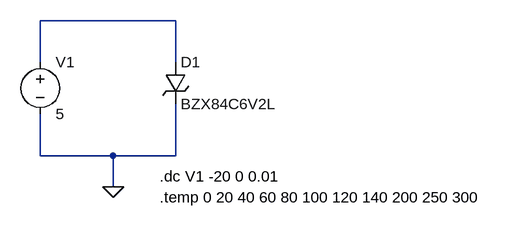
[diagram p0: schematic 1_c_Diodo_Zemer_Analisis_temp_e_Is_diferentes_.asc]
1_c_Diodo_Zemer_Analisis_temp_e_Is_diferentes_.asc, the LTspice schematic file:
Version 4
SHEET 1 880 680
WIRE 112 48 -96 48
WIRE -96 112 -96 48
WIRE 112 112 112 48
WIRE -96 256 -96 192
WIRE 16 256 -96 256
WIRE 112 256 112 176
WIRE 112 256 16 256
WIRE 16 304 16 256
FLAG 16 304 0
SYMBOL voltage -96 96 R0
WINDOW 123 0 0 Left 0
WINDOW 39 0 0 Left 0
SYMATTR InstName V1
SYMATTR Value 5
SYMBOL zener 96 112 R0
SYMATTR InstName D1
SYMATTR Value BZX84C6V2L
SYMATTR Description Diode
SYMATTR Type diode
TEXT 88 288 Left 2 !.dc V1 -20 0 0.01
TEXT 88 320 Left 2 !.temp 0 20 40 60 80 100 120 140 200 250 300

The netlist it stands for:
* 1_c_Diodo_Zemer_Analisis_temp_e_Is_diferentes_.asc
V1 N001 0 5
D1 N001 0 BZX84C6V2L
.model D D
.lib standard.dio
.dc V1 -20 0 0.01
.temp 0 20 40 60 80 100 120 140 200 250 300
.backanno
.end